# Altium project TRACE-4.PrjPcb
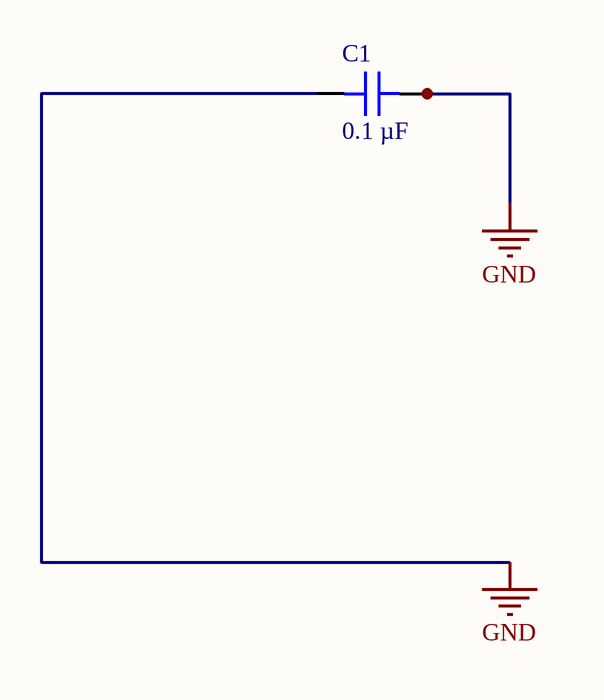
[diagram p0: trace_4.SchDoc]
1 sheet, 1 parts. Net scope: global (net labels, ports and power ports of the same name join across sheets).
Board file: trace_4.PcbDoc

## Sheet trace_4.SchDoc
size A4; SheetNumber: 1; SheetTotal: 1

### Parts
C1  0.1 µF  [CAP 01005_0402]

### Nets
GND: C1.1 C1.2

### Notes on the sheet
- TITLE:
- DOCUMENT NAME:
- AUTHOR :
- REVIEWER:
- This document is created by/ for Mitai. Any further questions can be asked through
- Sheet
- PART NO.:
- of
- DATE:
- *
- TEMPLATE:
- team@mitai.ai.
- A4
- Contact Address:Rosenheimer Straße 116b,81669, München.

### Library data of the parts
C1 = CL02A104KQ2NNNC: CAP CER 0.1UF 6.3V X5R 01005; manufacturer: Samsung Electro-Mechanics; Tolerance: ±10%; Part Number: CL02A104KQ2NNNC; Value: 0.1 µF; Applications: General Purpose; Capacitance: 0.1 µF; componentlink1description: Datasheet; componentlink1url: http://www.samsungsem.com/kr/support/product-search/mlcc/CL02A104KQ2NNNC.jsp; componentlink2description: DigiKey Link; componentlink2url: https://www.digikey.com/en/products/detail/samsung-electro-mechanics/CL02A104KQ2NNNC/3886867; Device Package: 01005 (0402 Metric); lastupdated: 29/08/2023 20:40:53; Lifecycle Status: Active; Minimum Order: 1; Mounting Type: Surface Mount, MLCC; Operating Temperature: -55°C ~ 85°C; Package / Case: 01005 (0402 Metric); packaging: TapeAndReel; Part Status: Active; price: 0.02; series: CL; Size / Dimension: 0.016" L x 0.008" W (0.40mm x 0.20mm); Supplier 1: DigiKey; Supplier Part Number 1: 1276-1209-1-ND; Temperature Coefficient: X5R; Thickness (Max): 0.009" (0.22mm); Voltage - Rated: 6.3V